# EAGLE design arm_slave_2022 (EAGLE 9.6.2)
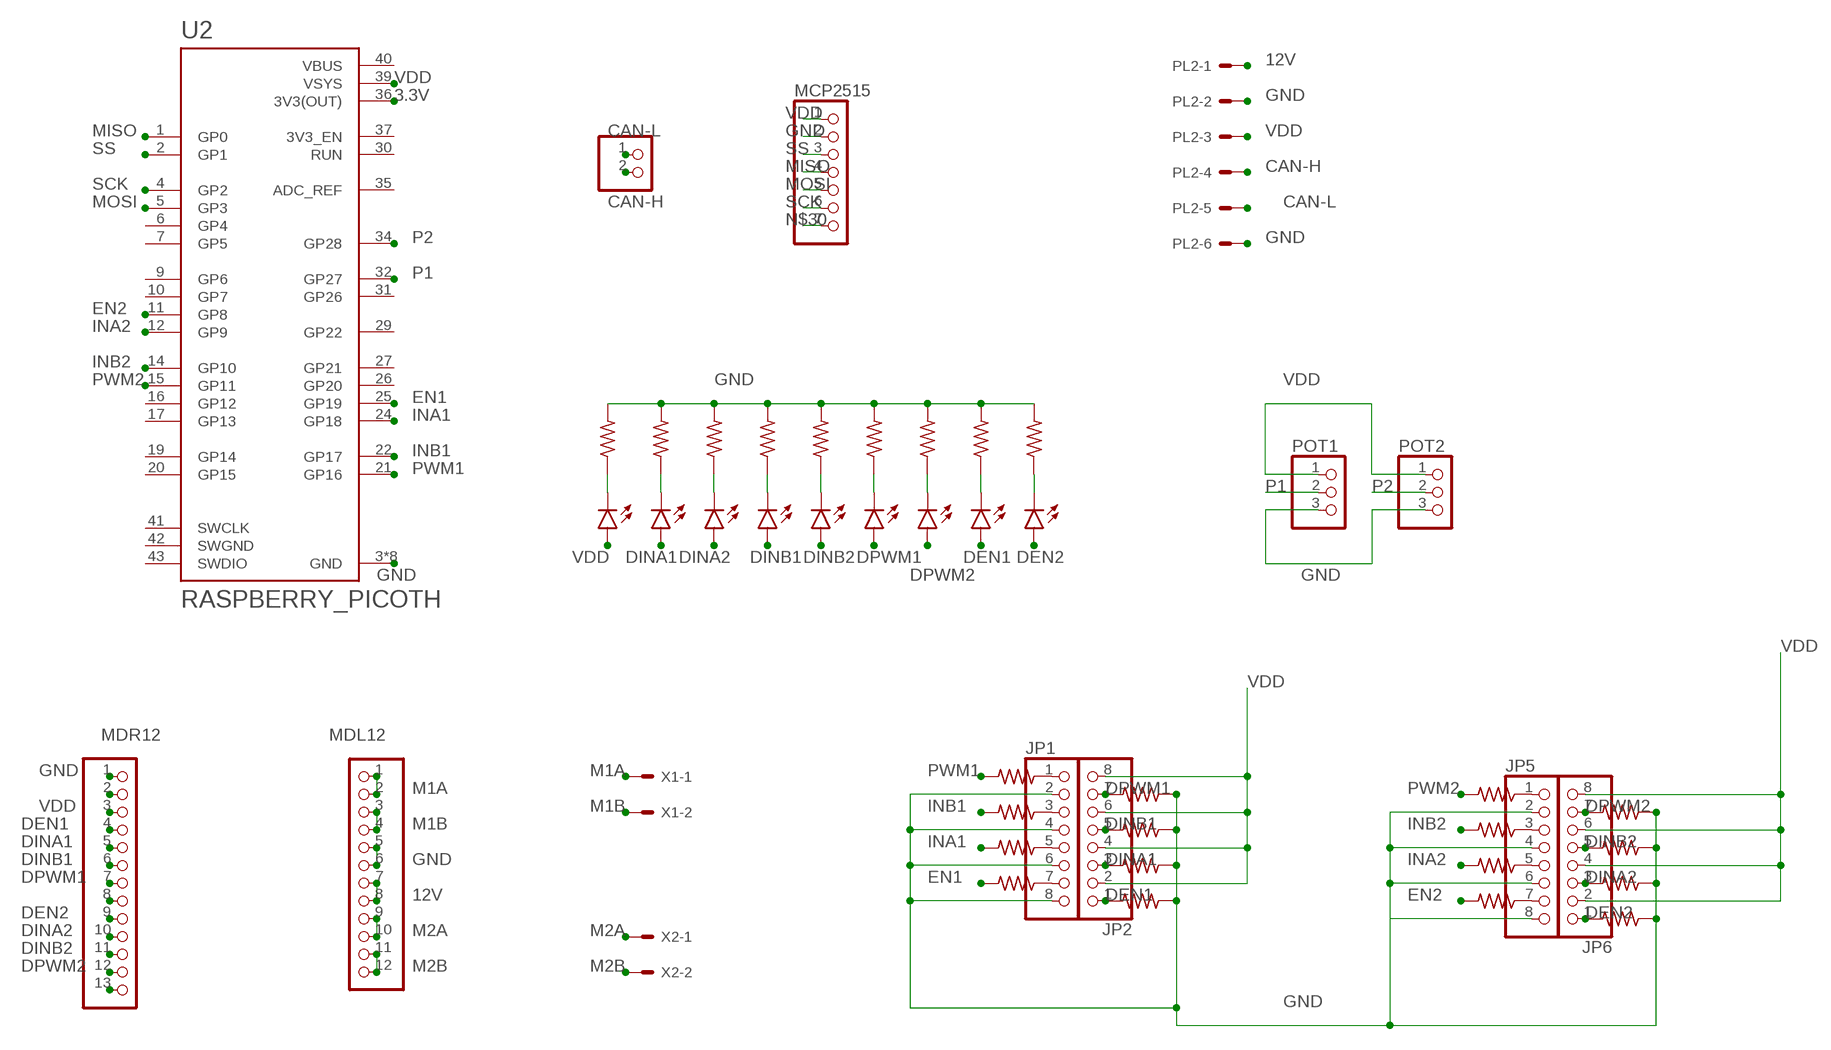
[diagram p0: schematic, sheet 1]

## Parts
CAN_L  CAN_H  PINHD-1X2  [1X02]
EN1  LEDSMT1206  [1206]
EN2  LEDSMT1206  [1206]
INA1  LEDSMT1206  [1206]
INA2  LEDSMT1206  [1206]
INB1  LEDSMT1206  [1206]
INB2  LEDSMT1206  [1206]
JP1  PINHD-1X8BIG  [1X08-BIG]
JP2  PINHD-1X8BIG  [1X08-BIG]
JP5  PINHD-1X8BIG  [1X08-BIG]
JP6  PINHD-1X8BIG  [1X08-BIG]
MCP2515  PINHD-1X7  [1X07]
MDL  MDL12  PINHD-1X12  [1X12]
MDR  MDR12  PINHD-1X13  [1X13]
PL2  555X-6V  [5566-6]
POT1  PINHD-1X3  [1X03]
POT2  PINHD-1X3  [1X03]
PWM1  LEDSMT1206  [1206]
PWM2  LEDSMT1206  [1206]
R3  R-US_R0805  [R0805]
R4  R-US_R0805  [R0805]
R5  R-US_R0805  [R0805]
R6  R-US_R0805  [R0805]
R9  R-US_R0805  [R0805]
R11  R-US_R0805  [R0805]
R14  R-US_R0805  [R0805]
R15  R-US_R0805  [R0805]
R16  R-US_R0805  [R0805]
R17  R-US_R0805  [R0805]
R18  R-US_R0805  [R0805]
R19  R-US_R0805  [R0805]
R20  R-US_R0805  [R0805]
R33  R-US_R0805  [R0805]
R34  R-US_R0805  [R0805]
R56  R-US_R0805  [R0805]
R58  R-US_R0805  [R0805]
R59  R-US_R0805  [R0805]
R60  R-US_R0805  [R0805]
R61  R-US_R0805  [R0805]
R62  R-US_R0805  [R0805]
R63  R-US_R0805  [R0805]
R64  R-US_R0805  [R0805]
R65  R-US_R0805  [R0805]
R66  R-US_R0805  [R0805]
U2  RASPBERRY_PICOTH  [PICO-PKG-TH]
VDD  LEDSMT1206  [1206]
X1  KK-156-2  [KK-156-2]
X2  KK-156-2  [KK-156-2]

## Nets
3.3V: U2.36(3V3(OUT))
12V: MDL.7 MDL.8 PL2.1
CAN-H: CAN_L.2 PL2.4
CAN-L: CAN_L.1 PL2.5
DEN1: EN1.A JP2.1 MDR.4 R11.2
DEN2: EN2.A JP6.1 MDR.9 R58.2
DINA1: INA1.A JP2.3 MDR.5 R4.2
DINA2: INA2.A JP6.3 MDR.10 R6.2
DINB1: INB1.A JP2.5 MDR.6 R9.2
DINB2: INB2.A JP6.5 MDR.11 R56.2
DPWM1: JP2.7 MDR.7 PWM1.A R3.2
DPWM2: JP6.7 MDR.12 PWM2.A R5.2
EN1: R62.2 U2.25(GP19)
EN2: R66.2 U2.11(GP8)
GND: JP1.2 JP1.4 JP1.6 JP1.8 JP5.2 JP5.4 JP5.6 JP5.8 MCP2515.2 MDL.5 MDL.6 MDR.1 PL2.2 PL2.6 POT1.3 POT2.3 R3.1 R5.1 R14.2 R15.2 R16.2 R17.2 R18.2 R19.2 R20.2 R33.2 R34.2 U2.3(GND) U2.8(GND) U2.13(GND) U2.18(GND) U2.23(GND) U2.28(GND) U2.33(GND) U2.38(GND)
INA1: R61.2 U2.24(GP18)
INA2: R65.2 U2.12(GP9)
INB1: R60.2 U2.22(GP17)
INB2: R64.2 U2.14(GP10)
M1A: MDL.1 MDL.2 X1.1
M1B: MDL.3 MDL.4 X1.2
M2A: MDL.9 MDL.10 X2.1
M2B: MDL.11 MDL.12 X2.2
MISO: MCP2515.4 U2.1(GP0)
MOSI: MCP2515.5 U2.5(GP3)
N$5: INA1.C R15.1
N$6: R9.1
N$7: R4.1
N$8: INA2.C R16.1
N$9: R11.1
N$11: R56.1
N$12: R6.1
N$13: R58.1
N$14: INB1.C R17.1
N$17: R14.1 VDD.C
N$18: INB2.C R18.1
N$19: PWM1.C R19.1
N$20: PWM2.C R20.1
N$21: EN1.C R33.1
N$24: EN2.C R34.1
N$28: MDR.2
N$30: MCP2515.7
N$34: MDR.8
N$39: MDR.13
N$46: JP1.1 R59.1
N$51: JP1.3 R60.1
N$52: JP1.5 R61.1
N$53: JP1.7 R62.1
N$54: JP5.1 R63.1
N$55: JP5.3 R64.1
N$56: JP5.5 R65.1
N$57: JP5.7 R66.1
P1: POT1.2 U2.32(GP27)
P2: POT2.2 U2.34(GP28)
PWM1: R59.2 U2.21(GP16)
PWM2: R63.2 U2.15(GP11)
SCK: MCP2515.6 U2.4(GP2)
SS: MCP2515.3 U2.2(GP1)
VDD: JP2.2 JP2.4 JP2.6 JP2.8 JP6.2 JP6.4 JP6.6 JP6.8 MCP2515.1 MDR.3 PL2.3 POT1.1 POT2.1 U2.39(VSYS) VDD.A
Unconnected: U2.6(GP4) U2.7(GP5) U2.9(GP6) U2.10(GP7) U2.16(GP12) U2.17(GP13) U2.19(GP14) U2.20(GP15) U2.26(GP20) U2.27(GP21) U2.29(GP22) U2.30(RUN) U2.31(GP26) U2.35(ADC_REF) U2.37(3V3_EN) U2.41(SWCLK) U2.43(SWDIO)

## Power pins joined to a net without a drawn wire
SWGND: U2.42(SWGND)
VBUS: U2.40(VBUS)

## Library data of the parts
CAN_L = pinhead:PINHD-1X2: PIN HEADER
EN1 EN2 INA1 INA2 INB1 INB2 PWM1 PWM2 VDD = led:LED: LED OSRAM: - CHIPLED LG R971, LG N971, LY N971, LG Q971, LY Q971, LO R971, LY R971 LH N974, LH R974 LS Q976, LO Q976, LY Q976 LO Q996 - Hyper CHIPLED LW Q18S LB Q993, LB Q99A, LB R99A - SideLED LS A670, LO A670, LY A670, LG A670, LP A670 LB A673, LV A673, LT A673, LW A673 LH A674 LY A675 LS A676, LA A676, LO A676, LY A676, LW A676 LS A679, LY A679, LG A679 - Hyper Micro SIDELED® LS Y876, LA Y876, LO Y876, LY Y876 LT Y87S - SmartLED LW L88C, LW L88S LB L89C, LB L89S, LG L890 LS L89K, LO L89K, LY L89K LS L896, LA L896, LO L896, LY L896 - TOPLED LS T670, LO T670, LY T670, LG T670, LP T670 LSG T670, LSP T670, LSY T670, LOP T670, LYG T670 LG T671, LOG T671, LSG T671 LB T673, LV T673, LT T673, LW T673 LH T674 LS T676, LA T676, LO T676, LY T676, LB T676, LH T676, LSB T676, LW T676 LB T67C, LV T67C, LT T67C, LS T67K, LO T67K, LY T67K, LW E67C LS E67B, LA E67B, LO E67B, LY E67B, LB E67C, LV E67C, LT E67C LW T67C LS T679, LY T679, LG T679 LS T770, LO T770, LY T770, LG T770, LP T770 LB T773, LV T773, LT T773, LW T773 LH T774 LS E675, LA E675, LY E675, LS T675 LS T776, LA T776, LO T776, LY T776, LB T776 LHGB T686 LT T68C, LB T68C - Hyper Mini TOPLED® LB M676 - Mini TOPLED Santana® LG M470 LS M47K, LO M47K, LY M47K Source: http://www.osram.convergy.de LUXEON: - LUMILED® LXK2-PW12-R00, LXK2-PW12-S00, LXK2-PW14-U00, LXK2-PW14-V00 LXK2-PM12-R00, LXK2-PM12-S00, LXK2-PM14-U00 LXK2-PE12-Q00, LXK2-PE12-R00, LXK2-PE12-S00, LXK2-PE14-T00, LXK2-PE14-U00 LXK2-PB12-K00, LXK2-PB12-L00, LXK2-PB12-M00, LXK2-PB14-N00, LXK2-PB14-P00, LXK2-PB14-Q00 LXK2-PR12-L00, LXK2-PR12-M00, LXK2-PR14-Q00, LXK2-PR14-R00 LXK2-PD12-Q00, LXK2-PD12-R00, LXK2-PD12-S00 LXK2-PH12-R00, LXK2-PH12-S00 LXK2-PL12-P00, LXK2-PL12-Q00, LXK2-PL12-R00 Source: www.luxeon.com KINGBRIGHT: KA-3528ASYC Source: www.kingbright.com
JP1 JP2 JP5 JP6 = adafruit:PINHD-1X8: PIN HEADER
MCP2515 = pinhead:PINHD-1X7: PIN HEADER
MDL = adafruit:PINHD-1X12: PIN HEADER
MDR = adafruit:PINHD-1X13: PIN HEADER
PL2 = anv-molex:555X-6: Mini FIT connector 6 way
POT1 POT2 = pinhead:PINHD-1X3: PIN HEADER
R3-R6 R9 R11 R14-R20 R33 R34 R56 R58-R66 = rcl:R-US_: RESISTOR, American symbol; SPICEPREFIX: R
U2 = RpiPico:RASPBERRY_PICO: Raspberry Pi Pico
X1 X2 = con-molex:KK-156-2: KK 156 HEADER Source: http://www.molex.com/pdm_docs/sd/026604100_sd.pdf; MF: MOLEX; OC_FARNELL: unknown; OC_NEWARK: unknown

## Net classes
0 default: width 0.508 mm, clearance 0.508 mm

## Board
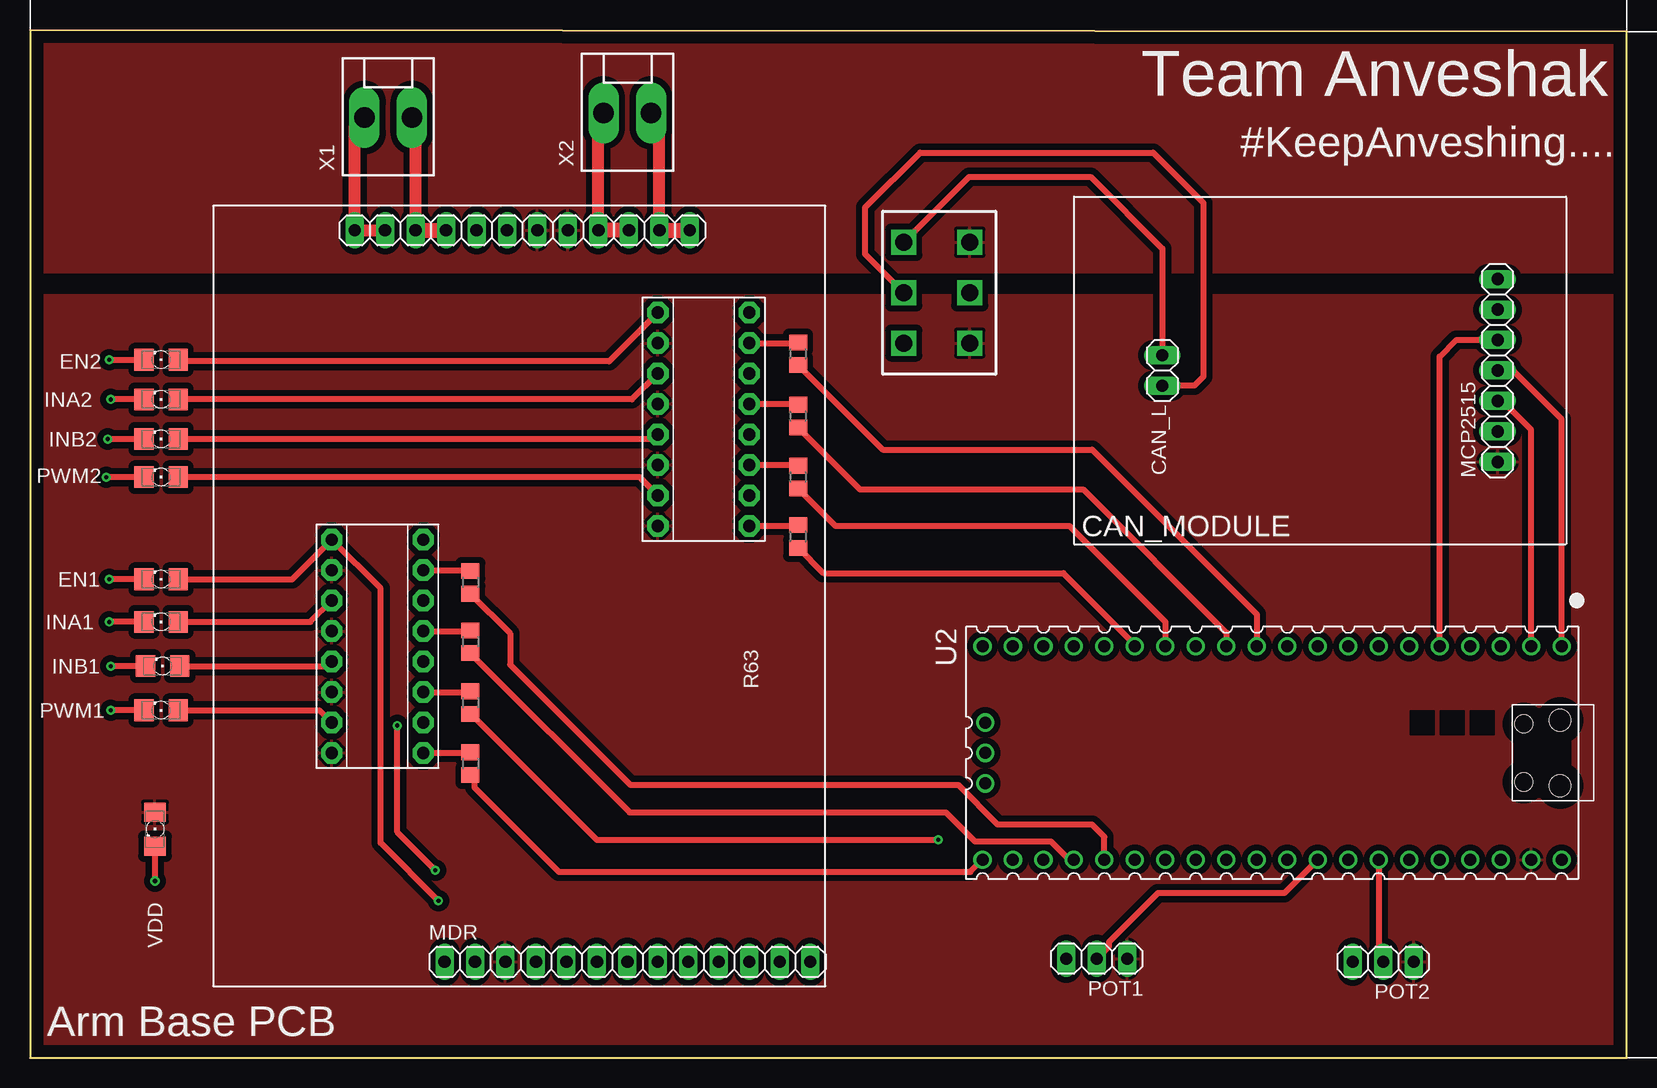
[diagram p1: board, top side]
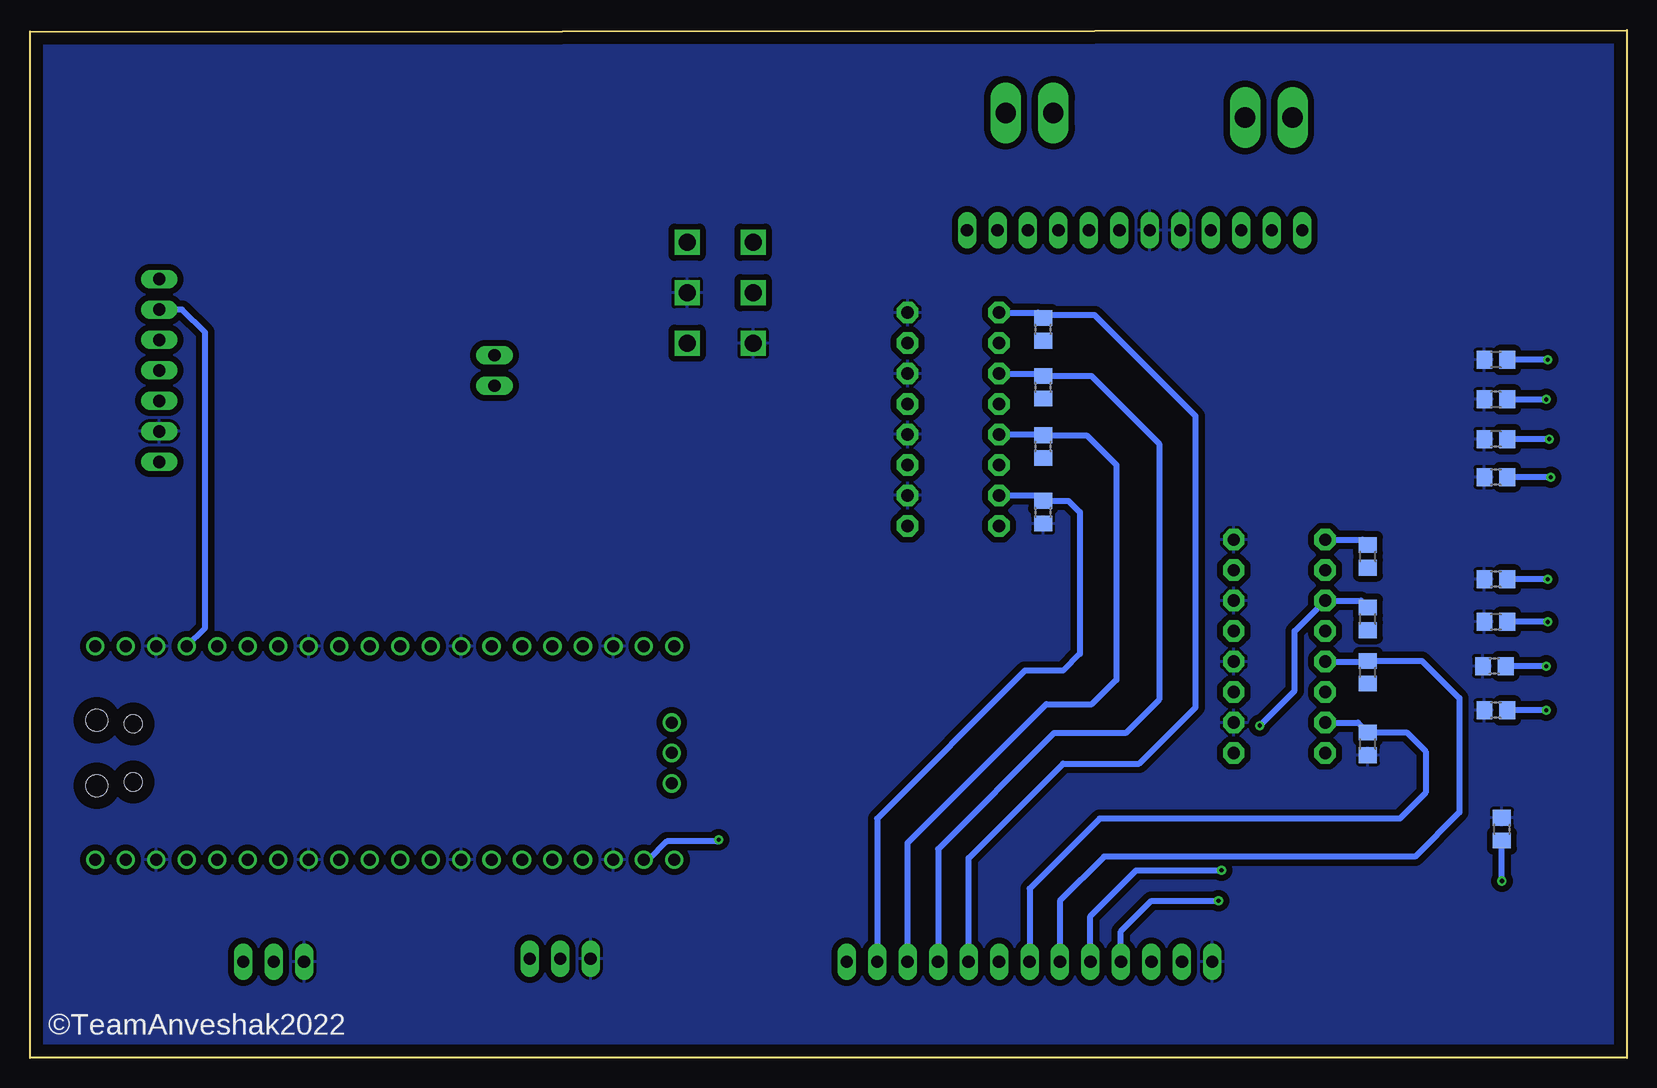
[diagram p2: board, bottom side, seen from below]

Size 133.08 x 85.65 mm. Coordinates in mm from the lower left corner, seen from the top.
Outline: 0,0 133.08,0 133.08,85.52 0,85.65 0,0
Copper layers (1*16): Top 0.035mm / dielectric 1.5mm / Bottom 0.035mm
Design rules "default *": minimum track width 6mil, minimum drill 0.35mm, track to track 20mil, track to pad 20mil, pad to pad 20mil, via to via 20mil, smd to smd 20mil, copper to edge 40mil, drill to drill 6mil, minimum pad ring 10mil, minimum via ring 8mil, stop-mask expansion 4mil, vias tented up to drill 0mil, thermal gap 10mil

### Footprints (pad centres in the part's own frame; a part is rotated, then mirrored left to right if it is on the bottom)
1X02 = drill 1.016 long: 1 -1.27,0; 2 1.27,0
1206 = smd 1.6 x 1.803: A -1.422,0; C 1.422,0
1X08-BIG = drill 1.016 pad 1.778 octagon: 1 -8.89,0; 2 -6.35,0; 3 -3.81,0; 4 -1.27,0; 5 1.27,0; 6 3.81,0; 7 6.35,0; 8 8.89,0
1X07 = drill 1.016 long: 1 -7.62,0; 2 -5.08,0; 3 -2.54,0; 4 0,0; 5 2.54,0; 6 5.08,0; 7 7.62,0
1X12 = drill 1.016 long: 1 -13.97,0; 2 -11.43,0; 3 -8.89,0; 4 -6.35,0; 5 -3.81,0; 6 -1.27,0; 7 1.27,0; 8 3.81,0; 9 6.35,0; 10 8.89,0; 11 11.43,0; 12 13.97,0
1X13 = drill 1.016 long: 1 -15.24,0; 2 -12.7,0; 3 -10.16,0; 4 -7.62,0; 5 -5.08,0; 6 -2.54,0; 7 0,0; 8 2.54,0; 9 5.08,0; 10 7.62,0; 11 10.16,0; 12 12.7,0; 13 15.24,0
5566-6 = drill 1.4 square: 1 4.2,-2.75; 2 0,-2.75; 3 -4.2,-2.75; 4 4.2,2.75; 5 0,2.75; 6 -4.2,2.75
1X03 = drill 1.016 long: 1 -2.54,0; 2 0,0; 3 2.54,0
R0805 = smd 1.3 x 1.5: 1 -0.95,0; 2 0.95,0
PICO-PKG-TH = drill 1: 1 -8.89,24.13; 2 -8.89,21.59; 3 -8.89,19.05; 4 -8.89,16.51; 5 -8.89,13.97; 6 -8.89,11.43; 7 -8.89,8.89; 8 -8.89,6.35; 9 -8.89,3.81; 10 -8.89,1.27; 11 -8.89,-1.27; 12 -8.89,-3.81; 13 -8.89,-6.35; 14 -8.89,-8.89; 15 -8.89,-11.43; 16 -8.89,-13.97; 17 -8.89,-16.51; 18 -8.89,-19.05; 19 -8.89,-21.59; 20 -8.89,-24.13; 21 8.89,-24.13; 22 8.89,-21.59; 23 8.89,-19.05; 24 8.89,-16.51; 25 8.89,-13.97; 26 8.89,-11.43; 27 8.89,-8.89; 28 8.89,-6.35; 29 8.89,-3.81; 30 8.89,-1.27; 31 8.89,1.27; 32 8.89,3.81; 33 8.89,6.35; 34 8.89,8.89; 35 8.89,11.43; 36 8.89,13.97; 37 8.89,16.51; 38 8.89,19.05; 39 8.89,21.59; 40 8.89,24.13; 41 -2.54,-23.9; 42 0,-23.9; 43 2.54,-23.9 | hole 1.8: -2.725,24; 2.725,24 | hole 1.5: -2.425,20.97; 2.425,20.97
KK-156-2 = drill 1.7 pad 2.184 long: 1 -1.98,0; 2 1.98,0

### Placement (x,y rotation side)
CAN_L  94.36,57.28 90 top
EN1  10.92,39.88 180 top
EN2  10.92,58.17 180 top
INA1  10.92,36.32 180 top
INA2  10.92,54.86 180 top
INB1  11.05,32.64 180 top
INB2  10.92,51.56 180 top
JP1  32.77,34.29 90 top
JP2  25.15,34.29 270 top
JP5  59.94,53.21 90 top
JP6  52.32,53.21 270 top
MCP2515  122.3,57.28 90 top
MDL  41.02,68.96 0 top
MDR  49.78,8 0 top
PL2  75.56,63.75 90 top
POT1  88.9,8.26 180 top
POT2  112.78,8 180 top
PWM1  10.92,28.96 180 top
PWM2  10.92,48.39 180 top
R3  21.59,26.16 90 bottom
R4  21.59,36.58 90 bottom
R5  48.64,45.47 90 bottom
R6  48.64,55.88 90 bottom
R9  21.59,32.13 90 bottom
R11  21.59,41.78 90 bottom
R14  10.41,19.05 90 bottom
R15  10.92,36.32 180 bottom
R16  10.92,54.86 180 bottom
R17  11.05,32.64 180 bottom
R18  10.92,51.56 180 bottom
R19  10.92,28.96 180 bottom
R20  10.92,48.39 180 bottom
R33  10.92,39.88 180 bottom
R34  10.92,58.17 180 bottom
R56  48.64,50.93 90 bottom
R58  48.64,60.71 90 bottom
R59  36.7,24.51 270 top
R60  36.7,29.59 270 top
R61  36.7,34.67 270 top
R62  36.7,39.62 270 top
R63  64.01,43.43 270 top
R64  64.01,48.39 270 top
R65  64.01,53.47 270 top
R66  64.01,58.67 270 top
U2  103.5,25.4 270 top
VDD  10.41,19.05 270 top
X1  29.84,78.36 0 top
X2  49.78,78.74 0 top

### Tracks (layer width: path | path; a pad name or v marks a point on that pad's centre or on a via)
12V
  pour Top: -2.67,65.41 137.16,65.41 137.16,89.41 -2.67,89.41
CAN-H
  Top 0.508: PL2.4 78.27,73.41 88.39,73.41 94.36,67.44 CAN_L.2
CAN-L
  Top 0.508: PL2.5 69.6,66.97 69.6,70.87 74.17,75.44 93.6,75.44 97.79,71.25 97.79,56.77 97.03,56.01 CAN_L.1
DEN1  (via drill 0.35)
  Top 0.508: EN1.A 21.84,39.88 JP2.1 29.21,39.12 29.21,17.91 v34.04,13.08
  Bottom 0.508: JP2.1 22.04,43.18 R11.2 | MDR.4 42.16,10.54 39.62,13.08 v34.04,13.08
DEN2
  Top 0.508: EN2.A 12.47,58.04 48.26,58.04 JP6.1
  Bottom 0.508: JP6.1 49.09,62.1 48.86,61.88 | 48.86,61.88 R58.2 | MDR.9 54.86,16.64 46.99,24.51 40.64,24.51 35.94,29.21 35.94,53.47 44.35,61.88 48.86,61.88
DINA1  (via drill 0.35)
  Top 0.508: INA1.A 23.37,36.32 JP2.3 | v33.78,15.62 30.61,18.8 v30.61,27.69
  Bottom 0.508: R4.2 22.16,38.1 JP2.3 27.69,35.56 27.69,30.61 v30.61,27.69 | MDR.5 44.7,11.81 40.89,15.62 v33.78,15.62
DINA2
  Top 0.508: JP6.3 50.16,54.86 INA2.A
  Bottom 0.508: JP6.3 48.83,57.02 R6.2 44.64,56.83 38.99,51.18 38.99,29.85 41.78,27.05 47.75,27.05 57.4,17.4 MDR.10
DINB1
  Top 0.508: INB1.A 24.77,32.64 JP2.5
  Bottom 0.508: JP2.5 21.65,33.02 R9.2 17.08,33.08 13.97,29.97 13.97,20.45 17.65,16.76 43.56,16.76 47.24,13.08 MDR.6
DINB2
  Top 0.508: JP6.5 51.94,51.56 INB2.A
  Bottom 0.508: JP6.5 48.71,51.94 R56.2 45.02,51.88 42.55,49.4 42.55,31.5 44.58,29.46 48.39,29.46 59.94,17.91 MDR.11
DPWM1
  Top 0.508: PWM1.A 24.13,28.96 JP2.7
  Bottom 0.508: JP2.7 22.42,27.94 R3.2 18.35,27.11 16.76,25.53 16.76,22.1 18.92,19.94 43.94,19.94 49.78,14.1 MDR.7
DPWM2
  Top 0.508: JP6.7 50.8,48.39 PWM2.A
  Bottom 0.508: JP6.7 49.09,46.86 R5.2 46.54,46.42 45.59,45.47 45.59,33.65 46.99,32.26 50.16,32.26 62.48,19.94 MDR.12
EN1
  Top 0.508: R62.2 40,35.37 40,32.77 50.04,22.73 77.34,22.73 80.65,19.43 88.52,19.43 89.53,18.41 U2.25
EN2
  Top 0.508: R66.2 71.06,50.67 88.52,50.67 102.24,36.96 U2.11
GND
  pour Bottom: -5.59,88.26 140.21,88.26 140.21,-4.57 -5.59,-4.57
INA1
  Top 0.508: U2.24 86.6,16.51 85.08,18.03 78.75,18.03 76.33,20.45 49.98,20.45 R61.2
INA2
  Top 0.508: R65.2 69.15,47.37 87.76,47.37 99.69,35.43 U2.12
INB1  (via drill 0.35)
  Top 0.508: R60.2 36.77,28.64 47.25,18.16 v75.69,18.16
  Bottom 0.508: U2.22 81.52,16.51 80,18.03 75.83,18.03 v75.69,18.16
INB2
  Top 0.508: R64.2 67.12,44.32 86.61,44.32 94.62,36.32 U2.14
M1A
  Top 1.016: X1.1 27.05,77.54 MDL.1 MDL.2
M1B
  Top 1.016: MDL.3 32.13,78.05 X1.2
  Top 1.27: MDL.3 MDL.4
M2A
  Top 1.016: MDL.9 47.37,78.31 X2.1
  Top 1.27: MDL.10 MDL.9
M2B
  Top 1.016: MDL.11 52.45,78.05 X2.2
  Top 1.27: MDL.11 MDL.12
MISO
  Top 0.508: U2.1 127.63,53.21 123.57,57.28 MCP2515.4
MOSI
  Top 0.508: U2.5 117.47,58.42 118.87,59.82 MCP2515.5
N$5  (via drill 0.35)
  Top 0.508: INA1.C v6.6,36.32
  Bottom 0.508: v6.6,36.32 R15.1
N$8  (via drill 0.35)
  Top 0.508: INA2.C v6.73,54.86
  Bottom 0.508: R16.1 v6.73,54.86
N$14  (via drill 0.35)
  Top 0.508: INB1.C v6.73,32.64
  Bottom 0.508: v6.73,32.64 R17.1
N$17  (via drill 0.35)
  Top 0.508: VDD.C v10.41,14.73
  Bottom 0.508: v10.41,14.73 R14.1
N$18  (via drill 0.35)
  Top 0.508: INB2.C v6.48,51.56
  Bottom 0.508: v6.48,51.56 R18.1
N$19  (via drill 0.35)
  Top 0.508: PWM1.C v6.73,28.96
  Bottom 0.508: v6.73,28.96 R19.1
N$20  (via drill 0.35)
  Top 0.508: PWM2.C v6.35,48.39
  Bottom 0.508: v6.35,48.39 R20.1
N$21  (via drill 0.35)
  Top 0.508: EN1.C v6.6,39.88
  Bottom 0.508: v6.6,39.88 R33.1
N$24  (via drill 0.35)
  Top 0.508: v6.6,58.17 EN2.C
  Bottom 0.508: v6.6,58.17 R34.1
N$46
  Top 0.508: JP1.1 36.64,25.4 R59.1
N$51
  Top 0.508: JP1.3 36.64,30.48 R60.1
N$52
  Top 0.508: JP1.5 36.64,35.56 R61.1
N$53
  Top 0.508: JP1.7 36.64,40.64 R62.1
N$54
  Top 0.508: JP5.1 63.95,44.32 R63.1
N$55
  Top 0.508: JP5.3 63.94,49.4 R64.1
N$56
  Top 0.508: JP5.5 63.94,54.48 R65.1
N$57
  Top 0.508: JP5.7 63.95,59.56 R66.1
P1
  Top 0.508: U2.32 104.52,13.72 93.98,13.72 89.92,9.65 89.92,9.27 POT1.2
P2
  Top 0.508: U2.34 112.4,8.38 POT2.2
PWM1
  Top 0.508: R59.2 37.02,23.56 37.02,22.54 44.07,15.49 78.36,15.49 U2.21
PWM2
  Top 0.508: U2.15 92.08,34.42 86.11,40.39 66.11,40.39 R63.2
SCK
  Bottom 0.508: U2.4 118.49,35.81 118.49,60.45 120.4,62.36 MCP2515.6
SS
  Top 0.508: MCP2515.3 122.68,54.74 125.1,52.32 U2.2
VDD
  pour Top: -2.41,63.63 137.16,63.63 137.16,-2.16 -2.41,-2.16

### Text on the board
tPlace: Team Anveshak | #KeepAnveshing.... | CAN_MODULE | Arm Base PCB
bPlace: ©TeamAnveshak2022